# Altium project project_cdh.PrjPcb
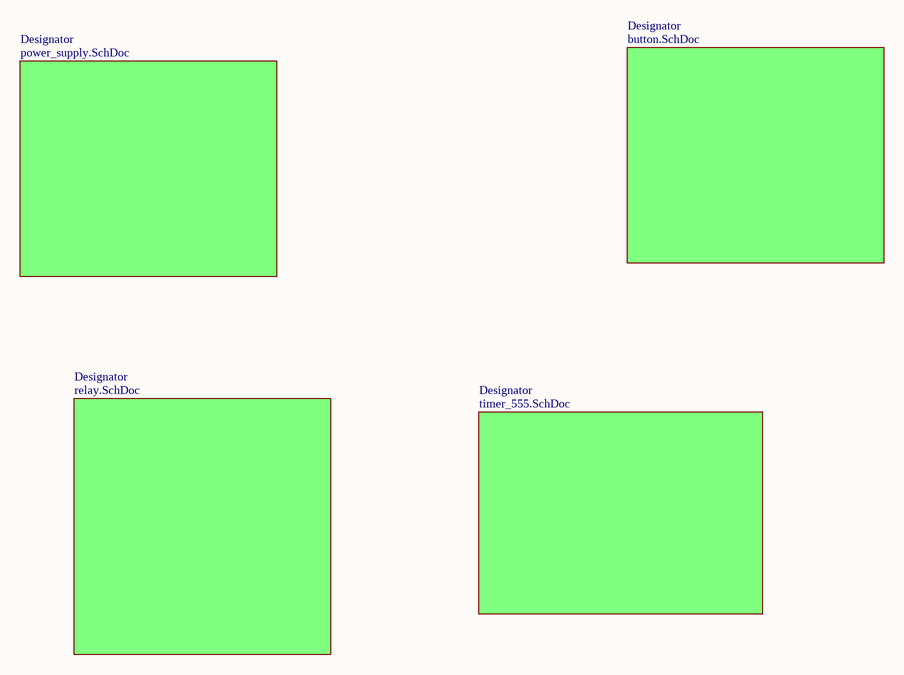
[diagram p0: project_cdh.SchDoc]
5 sheets, 1 parts. Net scope: global (net labels, ports and power ports of the same name join across sheets).
Board file: project_cdh.PcbDoc
Sheets:
  project_cdh.SchDoc
    Designator = power_supply.SchDoc
    Designator = button.SchDoc
    Designator = relay.SchDoc
    Designator = timer_555.SchDoc

## Sheet project_cdh.SchDoc
size A4; SheetNumber: 1; SheetTotal: 5

### Sub-sheets
Designator = power_supply.SchDoc: no entries
Designator = button.SchDoc: no entries
Designator = relay.SchDoc: no entries
Designator = timer_555.SchDoc: no entries

## Sheet power_supply.SchDoc
size A4; SheetNumber: 2; SheetTotal: 5; SPICEModelCacheAEYMAYMO: <root> / <DocumentId>AEYMAYMO</DocumentId> / </root>
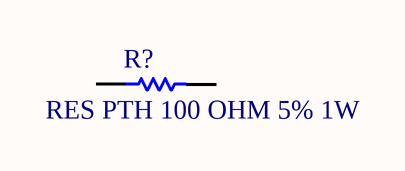
[diagram p1: power_supply.SchDoc]

### Parts
R?  RES PTH 100 OHM 5% 1W  [RESA60-630X240-2]

### Nets

Not connected (* = marked no-connect by the designer): R? 1 2

### Library data of the parts
R? = RES PTH 100 OHM 5% 1W: RES PTH 100 OHM 5% 1W / General Type Wirewound Resistor 100Ohm 1W 5% Axial T/R; Manufacturer: Yageo; Manufacturer Part Number: KNP100JR-52-100R; Resistance: 100R; Supplier 1: Arrow Electronics; RoHS: Yes; Category: Through-Hole Resistors; Stock 1: 743; Pricing 1: 1=0,07520, 10=0,05340, 25=0,04990, 100=0,04650, 250=0,04290, 500=0,03950 (USD); Case/Package: Axial; Min Operating Temperature: -40°C; Max Operating Temperature: 200°C; Tolerance: 5%; Packaging: Tape and Reel; Resistor Type: Wirewound; Number of Terminations: 2; Max Power Dissipation: 1W; Package Quantity: 1; Series: KNP; Features: Flame Retardant Coating; Length: 0.453inch; RoHS Compliant: Yes; Lead Free: Lead Free; ComponentLink1URL: https://datasheet.ciiva.com/2712/yageolr-knp-2013-2712454.pdf?src-supplier=Digi-Key; ComponentLink1Description: https://datasheet.ciiva.com/2712/yageolr-knp-2013-2712454.pdf?src-supplier=Digi-Key; ComponentLink2URL: https://datasheet.ciiva.com/2712/yageolr-knp-2013-2712455.pdf?src-supplier=Digi-Key; ComponentLink2Description: https://datasheet.ciiva.com/2712/yageolr-knp-2013-2712455.pdf?src-supplier=Digi-Key; Supplier Part Number 1: KNP100JR-52-100R

## Sheet button.SchDoc
size A4; SheetNumber: 5; SheetTotal: 5

## Sheet relay.SchDoc
size A4; SheetNumber: 5; SheetTotal: 5

## Sheet timer_555.SchDoc
size A4; SheetNumber: 3; SheetTotal: 3